# Altium schematic sheet rascal-1.2.schdoc: Rascal
size D; DrawnBy: Brandon Stafford; Engineer: Brandon Stafford; SheetNumber: 1; SheetTotal: 1; License: Creative Commons BY-SA-3_0-US; LicenseURL: http://creativecommons.org/licenses/by-sa/3.0/us/
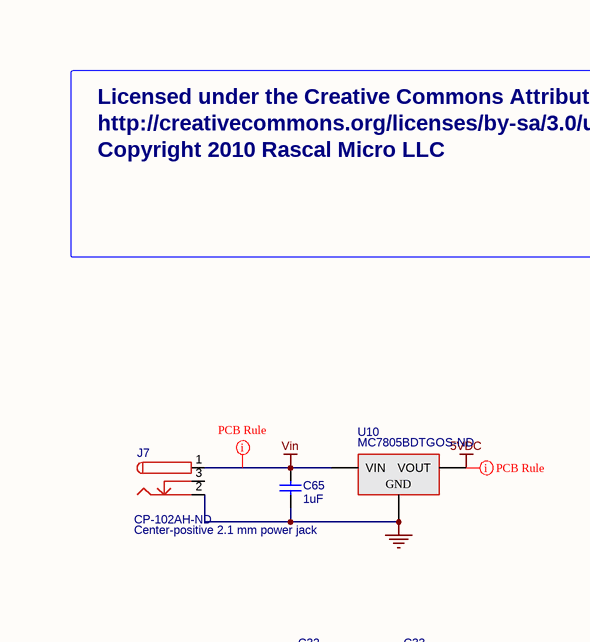
[diagram p0: rascal-1.2.schdoc, top left]
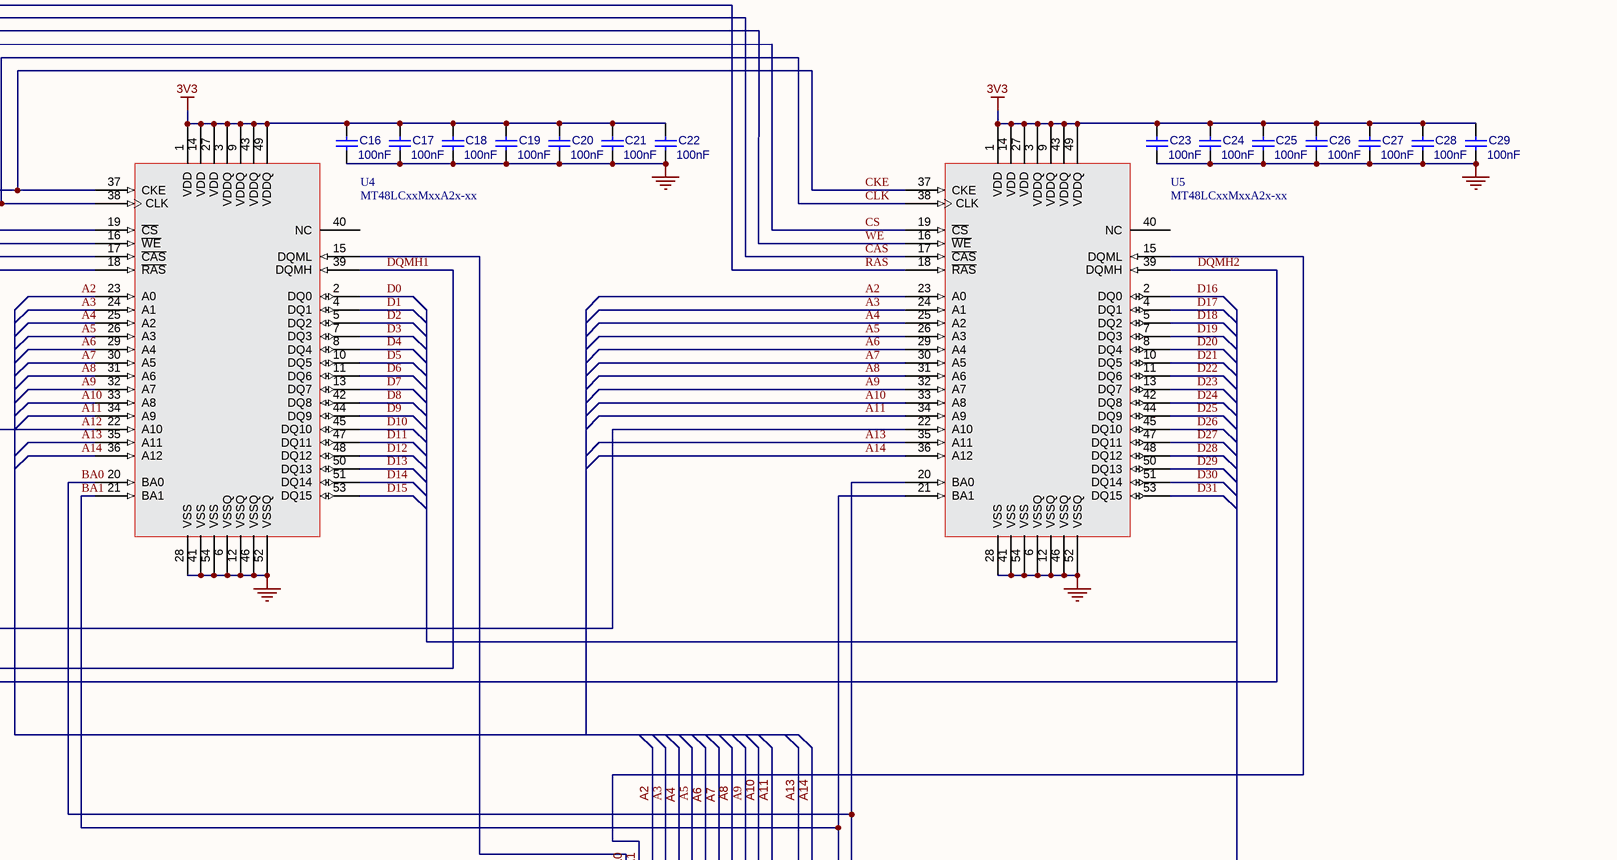
[diagram p1: rascal-1.2.schdoc, top right]
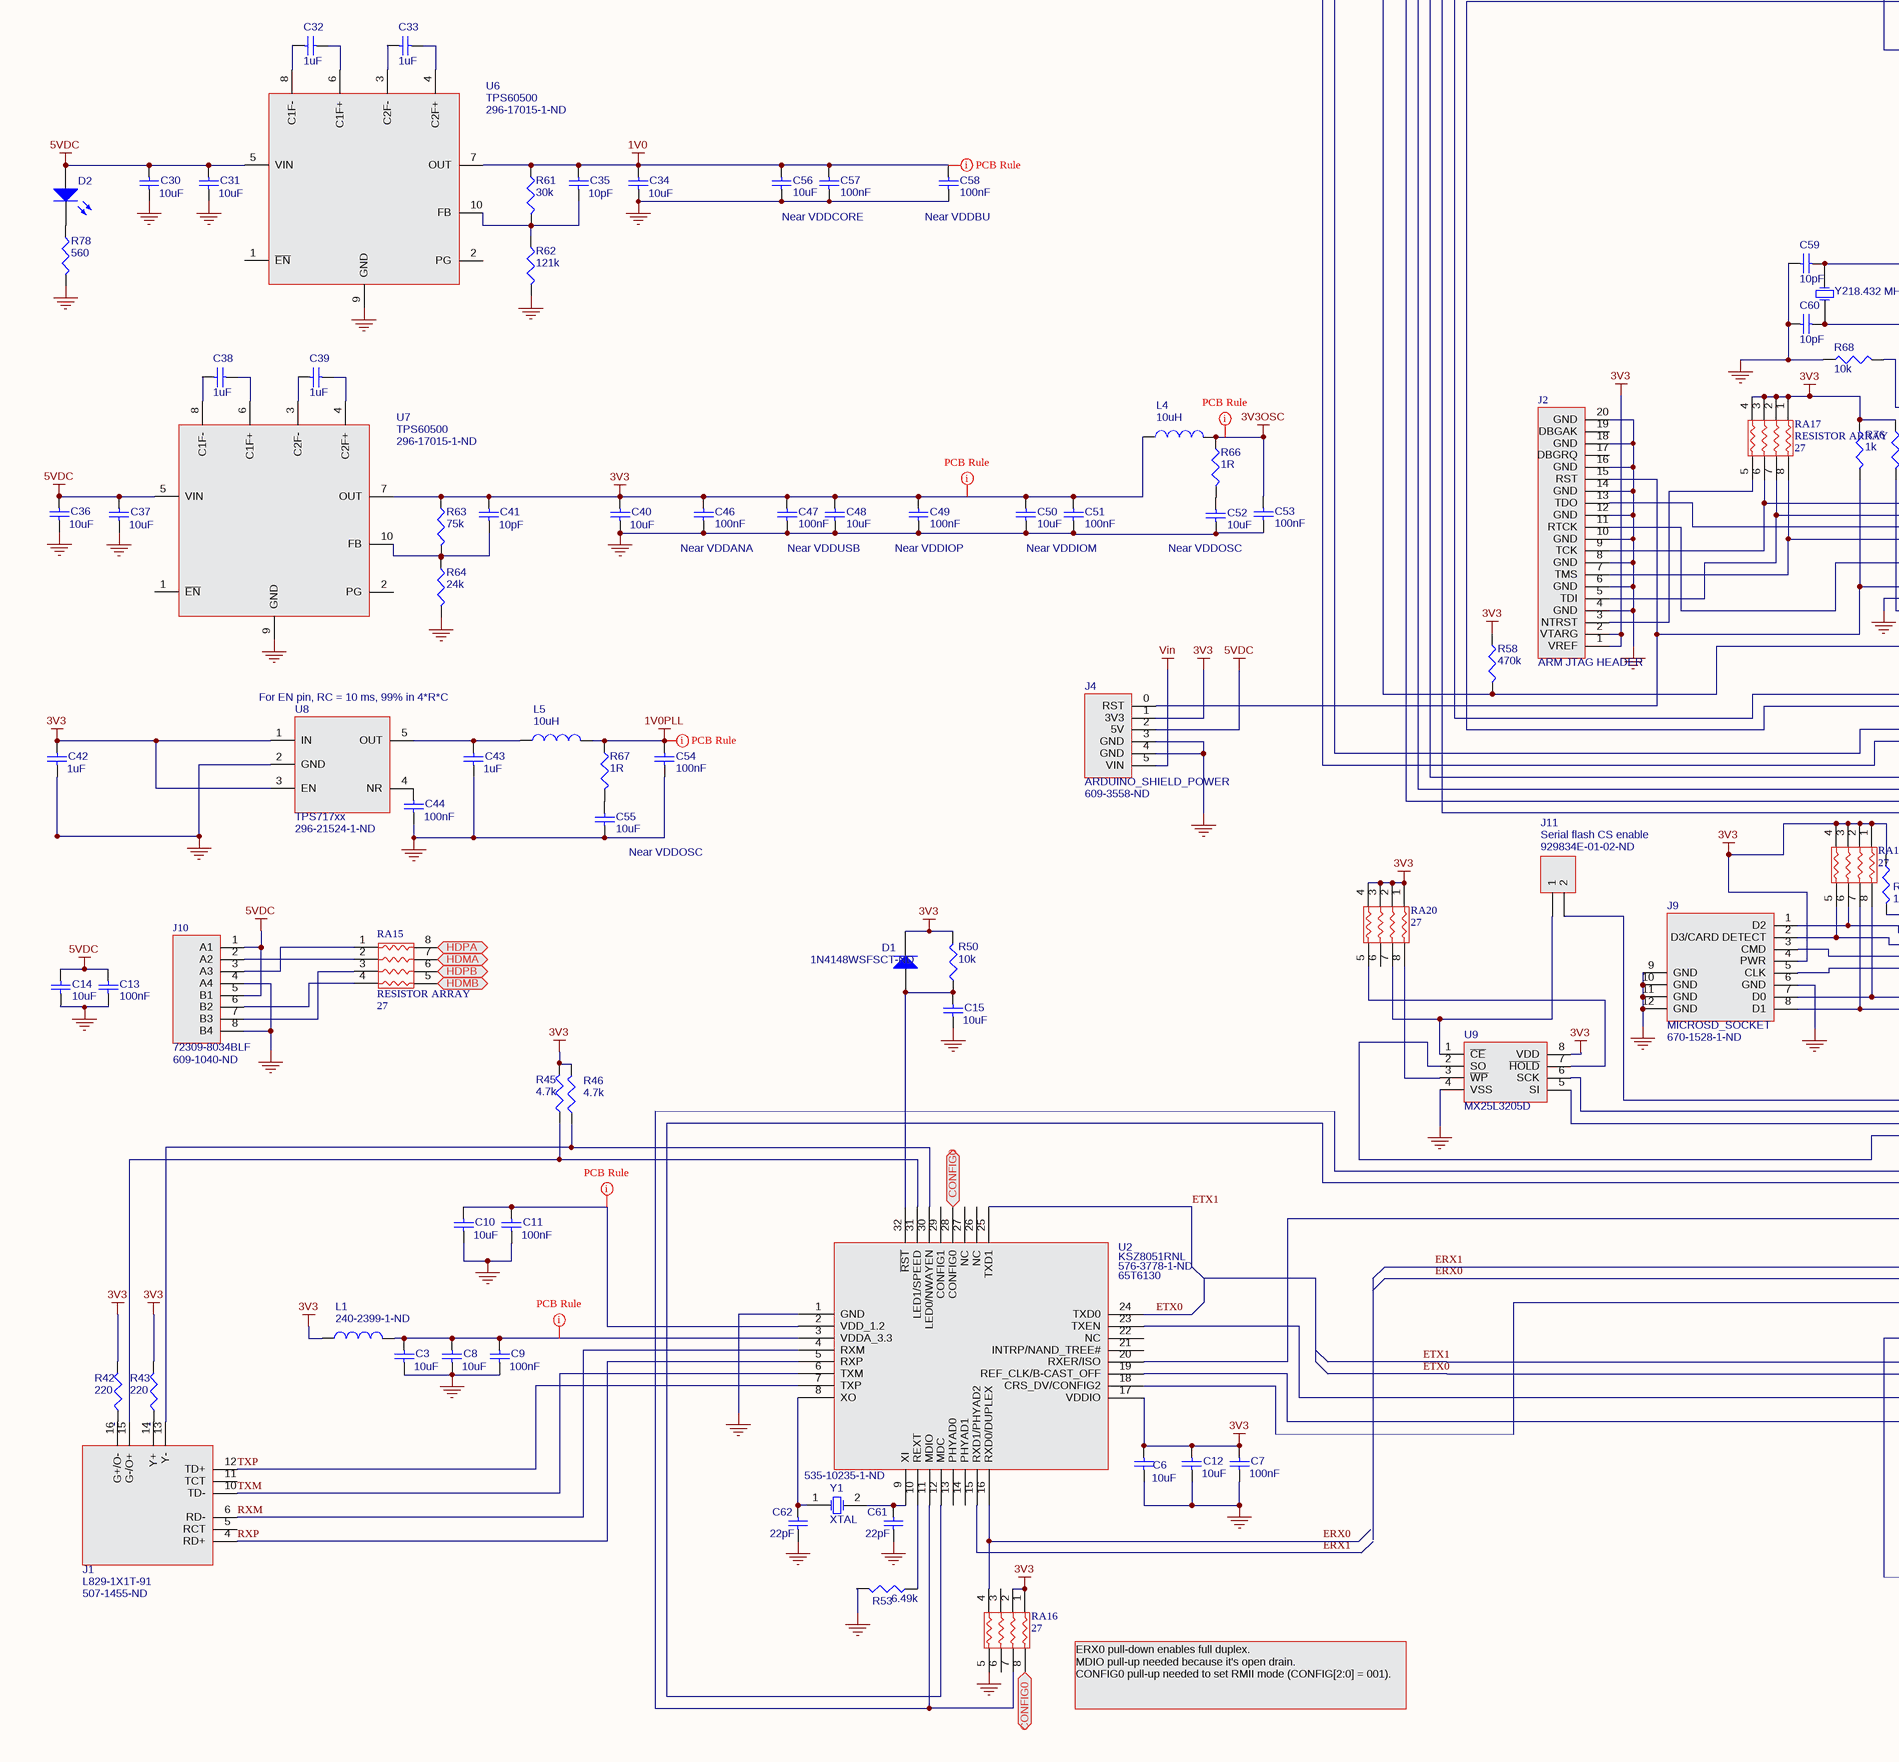
[diagram p2: rascal-1.2.schdoc, bottom left]
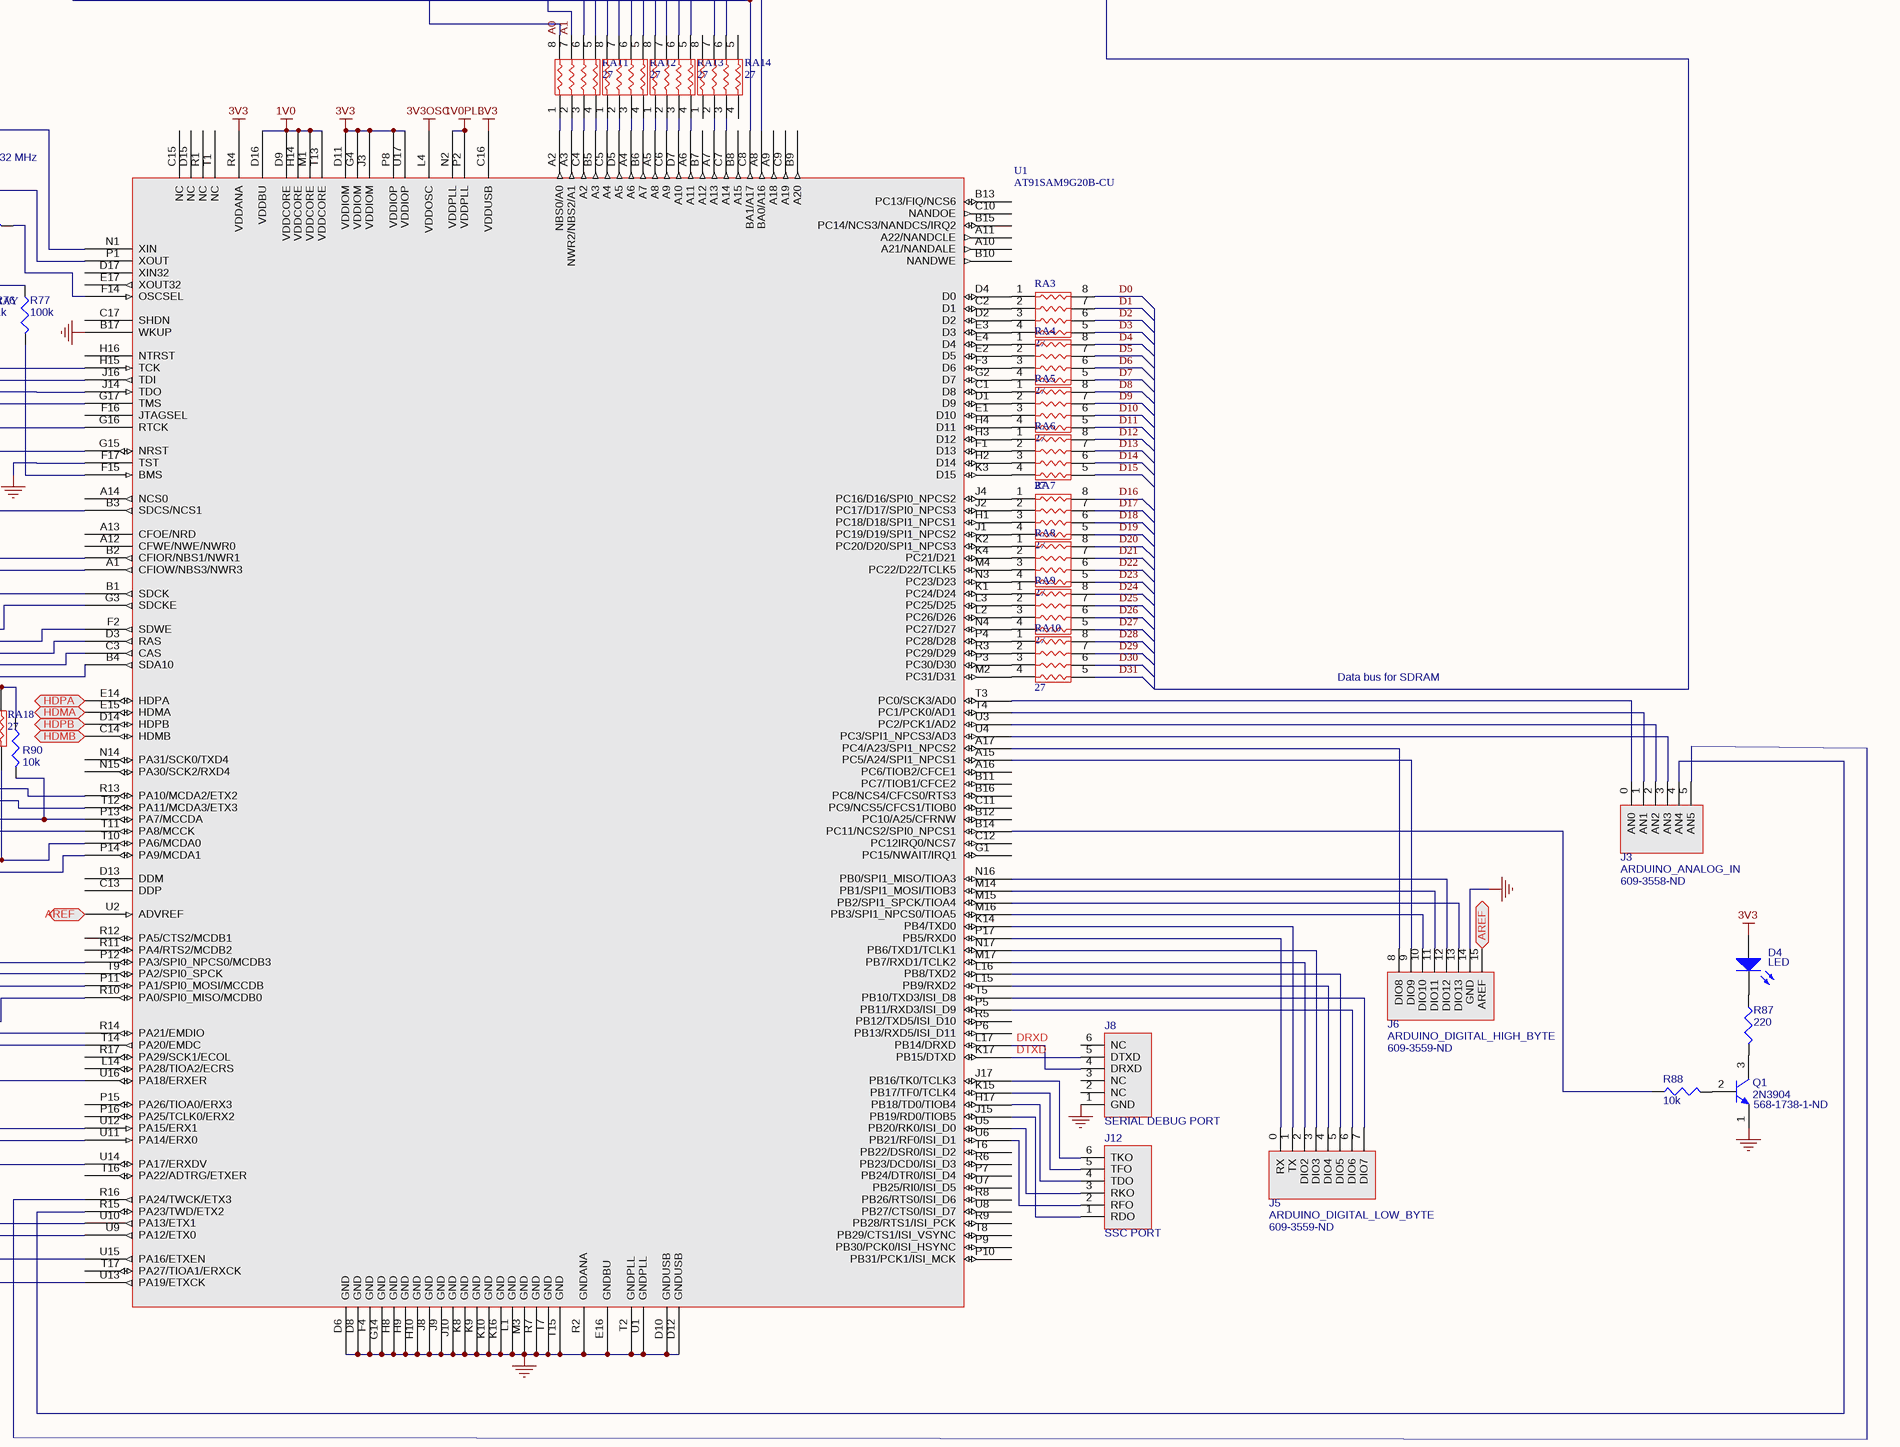
[diagram p3: rascal-1.2.schdoc, bottom right]

## Parts
C3  value 10uF  [CAPC2012N]  (hidden comment: Cap)
C6  value 10uF  [CAPC2012N]  (hidden comment: Cap)
C7  value 100nF  [CAPC1608N]  (hidden comment: Cap)
C8  value 10uF  [CAPC2012N]  (hidden comment: Cap)
C9  value 100nF  [CAPC1608N]  (hidden comment: Cap)
C10  value 10uF  [CAPC2012N]  (hidden comment: Cap)
C11  value 100nF  [CAPC1608N]  (hidden comment: Cap)
C12  value 10uF  [CAPC2012N]  (hidden comment: Cap)
C13  value 100nF  [CAPC1608N]  (hidden comment: Cap)
C14  value 10uF  [CAPC2012N]  (hidden comment: Cap)
C15  value 10uF  [CAPC2012N]  (hidden comment: Cap)
C16  value 100nF  [CAPC1608N]  (hidden comment: Cap)
C17  value 100nF  [CAPC1608N]  (hidden comment: Cap)
C18  value 100nF  [CAPC1608N]  (hidden comment: Cap)
C19  value 100nF  [CAPC1608N]  (hidden comment: Cap)
C20  value 100nF  [CAPC1608N]  (hidden comment: Cap)
C21  value 100nF  [CAPC1608N]  (hidden comment: Cap)
C22  value 100nF  [CAPC1608N]  (hidden comment: Cap)
C23  value 100nF  [CAPC1608N]  (hidden comment: Cap)
C24  value 100nF  [CAPC1608N]  (hidden comment: Cap)
C25  value 100nF  [CAPC1608N]  (hidden comment: Cap)
C26  value 100nF  [CAPC1608N]  (hidden comment: Cap)
C27  value 100nF  [CAPC1608N]  (hidden comment: Cap)
C28  value 100nF  [CAPC1608N]  (hidden comment: Cap)
C29  value 100nF  [CAPC1608N]  (hidden comment: Cap)
C30  value 10uF  [CAPC2012N]  (hidden comment: Cap)
C31  value 10uF  [CAPC2012N]  (hidden comment: Cap)
C32  value 1uF  [CAPC1608N]  (hidden comment: Cap)
C33  value 1uF  [CAPC1608N]  (hidden comment: Cap)
C34  value 10uF  [CAPC2012N]  (hidden comment: Cap)
C35  value 10pF  [CAPC1608N]  (hidden comment: Cap)
C36  value 10uF  [CAPC2012N]  (hidden comment: Cap)
C37  value 10uF  [CAPC2012N]  (hidden comment: Cap)
C38  value 1uF  [CAPC1608N]  (hidden comment: Cap)
C39  value 1uF  [CAPC1608N]  (hidden comment: Cap)
C40  value 10uF  [CAPC2012N]  (hidden comment: Cap)
C41  value 10pF  [CAPC1608N]  (hidden comment: Cap)
C42  value 1uF  [CAPC1608N]  (hidden comment: Cap)
C43  value 1uF  [CAPC1608N]  (hidden comment: Cap)
C44  value 100nF  [CAPC1608N]  (hidden comment: Cap)
C46  value 100nF  [CAPC1608N]  (hidden comment: Cap)
C47  value 100nF  [CAPC1608N]  (hidden comment: Cap)
C48  value 10uF  [CAPC2012N]  (hidden comment: Cap)
C49  value 100nF  [CAPC1608N]  (hidden comment: Cap)
C50  value 10uF  [CAPC2012N]  (hidden comment: Cap)
C51  value 100nF  [CAPC1608N]  (hidden comment: Cap)
C52  value 10uF  [CAPC2012N]  (hidden comment: Cap)
C53  value 100nF  [CAPC1608N]  (hidden comment: Cap)
C54  value 100nF  [CAPC1608N]  (hidden comment: Cap)
C55  value 10uF  [CAPC2012N]  (hidden comment: Cap)
C56  value 10uF  [CAPC2012N]  (hidden comment: Cap)
C57  value 100nF  [CAPC1608N]  (hidden comment: Cap)
C58  value 100nF  [CAPC1608N]  (hidden comment: Cap)
C59  value 10pF  [CAPC1608N]  (hidden comment: Cap)
C60  value 10pF  [CAPC1608N]  (hidden comment: Cap)
C61  value 22pF  [CAPC1608N]  (hidden comment: Cap)
C62  value 22pF  [CAPC1608N]  (hidden comment: Cap)
C65  value 1uF  [CAPC1608N]  (hidden comment: Cap)
D1  Supplier Part Number 1: 1N4148WSFSCT-ND  [SOD-323]  (hidden comment: Diode 1N4148)
D2  LED2  [CD2012-0805]  (value not drawn)
D4  LED  [CD2012-0805]
J1  L829-1X1T-91  Supplier Part Number 1: 507-1455-ND  [Bel L829-1X1T-91]
J2  ARM JTAG HEADER  [HDR1X10]
J3  ARDUINO_ANALOG_IN  Supplier Part Number 1: 609-3558-ND  [HDR1X6]
J4  ARDUINO_SHIELD_POWER  Supplier Part Number 1: 609-3558-ND  [HDR1X6]
J5  ARDUINO_DIGITAL_LOW_BYTE  Supplier Part Number 1: 609-3559-ND  [HDR1X8]
J6  ARDUINO_DIGITAL_HIGH_BYTE  Supplier Part Number 1: 609-3559-ND  [HDR1X8]
J7  Center-positive 2.1 mm power jack  Supplier Part Number 1: CP-102AH-ND  [PJ-102AH]
J8  SERIAL DEBUG PORT  [HDR1X6]
J9  MICROSD_SOCKET  Supplier Part Number 1: 670-1528-1-ND  [JAE SJ107021]
J10  72309-8034BLF  Supplier Part Number 2: 609-1040-ND  [72309-8034BLF]
J11  Serial flash CS enable  Supplier Part Number 1: 929834E-01-02-ND  [HDR1X2]
J12  SSC PORT  [HDR1X6]
L1  Supplier Part Number 1: 240-2399-1-ND  [INDC2012L]  (hidden comment: Inductor)
L4  value 10uH  [INDC2012L]  (hidden comment: Inductor)
L5  value 10uH  [INDC2012L]  (hidden comment: Inductor)
Q1  2N3904  Supplier Part Number 1: 568-1738-1-ND  [SOT23-3N]
R42  value 220  [RESC2012N]  (hidden comment: Res3)
R43  value 220  [RESC2012N]  (hidden comment: Res3)
R45  value 4.7k  [RESC2012N]  (hidden comment: Res3)
R46  value 4.7k  [RESC2012N]  (hidden comment: Res3)
R50  value 10k  [RESC2012N]  (hidden comment: Res3)
R53  value 6.49k  [RESC2012N]  (hidden comment: Res3)
R58  value 470k  [RESC2012N]  (hidden comment: Res3)
R61  value 30k  [RESC2012N]  (hidden comment: Res3)
R62  value 121k  [RESC2012N]  (hidden comment: Res3)
R63  value 75k  [RESC2012N]  (hidden comment: Res3)
R64  value 24k  [RESC2012N]  (hidden comment: Res3)
R66  value 1R  [RESC2012N]  (hidden comment: Res3)
R67  value 1R  [RESC2012N]  (hidden comment: Res3)
R68  value 10k  [RESC2012N]  (hidden comment: Res3)
R76  value 1k  [RESC2012N]  (hidden comment: Res3)
R77  value 100k  [RESC2012N]  (hidden comment: Res3)
R78  value 560  [RESC2012N]  (hidden comment: Res3)
R87  value 220  [RESC2012N]  (hidden comment: Res3)
R88  value 10k  [RESC2012N]  (hidden comment: Res3)
R90  value 10k  [RESC2012N]  (hidden comment: Res3)
RA3  value 27  [742C083]  (hidden comment: RESISTOR ARRAY)
RA4  value 27  [742C083]  (hidden comment: RESISTOR ARRAY)
RA5  value 27  [742C083]  (hidden comment: RESISTOR ARRAY)
RA6  value 27  [742C083]  (hidden comment: RESISTOR ARRAY)
RA7  value 27  [742C083]  (hidden comment: RESISTOR ARRAY)
RA8  value 27  [742C083]  (hidden comment: RESISTOR ARRAY)
RA9  value 27  [742C083]  (hidden comment: RESISTOR ARRAY)
RA10  value 27  [742C083]  (hidden comment: RESISTOR ARRAY)
RA11  value 27  [742C083]  (hidden comment: RESISTOR ARRAY)
RA12  value 27  [742C083]  (hidden comment: RESISTOR ARRAY)
RA13  value 27  [742C083]  (hidden comment: RESISTOR ARRAY)
RA14  value 27  [742C083]  (hidden comment: RESISTOR ARRAY)
RA15  RESISTOR ARRAY  value 27  [742C083]
RA16  value 27  [742C083]  (hidden comment: RESISTOR ARRAY)
RA17  RESISTOR ARRAY  value 27  [742C083]
RA18  value 27  [742C083]  (hidden comment: RESISTOR ARRAY)
RA20  value 27  [742C083]  (hidden comment: RESISTOR ARRAY)
U1  AT91SAM9G20B-CU  [AT91SAM9G20-CU]
U2  KSZ8051RNL  Supplier Part Number 1: 576-3778-1-ND  Supplier Part Number 2: 65T6130  [QFN50P500X500-32VBN]
U4  MT48LCxxMxxA2x-xx  [TSOP2-54_N]
U5  MT48LCxxMxxA2x-xx  [TSOP2-54_N]
U6  TPS60500  Supplier Part Number 1: 296-17015-1-ND  [TSSOP50P490-10AN]
U7  TPS60500  Supplier Part Number 1: 296-17015-1-ND  [TSSOP50P490-10AN]
U8  TPS717xx  Supplier Part Number 1: 296-21524-1-ND  [SOT353-5AN]
U9  MX25L3205D  [SOP127P780-8N]
U10  Supplier Part Number 1: MC7805BDTGOS-ND  [DPAK-3]  (hidden comment: VOLT REG)
Y1  XTAL  Supplier Part Number 1: 535-10235-1-ND  [HC49/4H_SMX]
Y2  18.432 MHz  [HC49/4H_SMX]

## Ports
AREF (out), CONFIG0 (out), HDMA (out), HDMB (out), HDPA (out), HDPB (out)

## Nets
1V0: C34.1 C35.1 C56.2 C57.2 C58.2 R61.1 U1.D9(VDDCORE) U1.D16(VDDBU) U1.H14(VDDCORE) U1.M1(VDDCORE) U1.T13(VDDCORE) U6.7(OUT)
1V0PLL: C54.2 L5.2 R67.1 U1.N2(VDDPLL) U1.P2(VDDPLL)
3V3: C6.1 C7.1 C12.1 C16.1 C17.1 C18.1 C19.1 C20.1 C21.1 C22.1 C23.1 C24.1 C25.1 C26.1 C27.1 C28.1 C29.1 C40.1 C41.1 C42.1 C46.1 C47.2 C48.2 C49.2 C50.2 C51.2 D1.2(K) D4.1(A) J2.1(VREF) J2.2(VTARG) J4.1(3V3) J9.4(PWR) L1.1 L4.1 R42.2 R43.2 R45.2 R46.2 R50.2 R58.1 R63.1 R76.1 R77.1 R90.1 RA16.1 RA16.2 RA17.1 RA17.2 RA17.3 RA17.4 RA18.1 RA18.2 RA18.3 RA18.4 RA20.1 RA20.2 RA20.3 RA20.4 U1.C16(VDDUSB) U1.D11(VDDIOM) U1.G4(VDDIOM) U1.J3(VDDIOM) U1.P8(VDDIOP) U1.R4(VDDANA) U1.U17(VDDIOP) U2.17(VDDIO) U4.1(VDD) U4.3(VDDQ) U4.9(VDDQ) U4.14(VDD) U4.27(VDD) U4.43(VDDQ) U4.49(VDDQ) U5.1(VDD) U5.3(VDDQ) U5.9(VDDQ) U5.14(VDD) U5.27(VDD) U5.43(VDDQ) U5.49(VDDQ) U7.7(OUT) U8.1(IN) U8.3(EN) U9.8(VDD)
3V3OSC: C53.2 L4.2 R66.1 U1.L4(VDDOSC)
5VDC: C13.2 C14.2 C30.1 C31.1 C36.1 C37.1 D2.1(A) J4.2(5V) J10.1(A1) J10.5(B1) U6.5(VIN) U7.5(VIN) U10.3(VOUT)
GND: C3.2 C6.2 C7.2 C8.2 C9.2 C10.2 C11.2 C12.2 C13.1 C14.1 C15.2 C16.2 C17.2 C18.2 C19.2 C20.2 C21.2 C22.2 C23.2 C24.2 C25.2 C26.2 C27.2 C28.2 C29.2 C30.2 C31.2 C34.2 C36.2 C37.2 C40.2 C42.2 C43.2 C44.2 C46.2 C47.1 C48.1 C49.1 C50.1 C51.1 C52.1 C53.1 C54.1 C55.1 C56.1 C57.1 C58.1 C59.1 C60.1 C61.2 C62.2 C65.1 J2.4(GND) J2.6(GND) J2.8(GND) J2.10(GND) J2.12(GND) J2.14(GND) J2.16(GND) J2.18(GND) J2.20(GND) J4.3(GND) J4.4(GND) J6.14(GND) J7.2 J8.1(GND) J9.6(GND) J9.9(GND) J9.10(GND) J9.11(GND) J9.12(GND) J10.4(A4) J10.8(B4) Q1.1(E) R53.2 R62.2 R64.2 R68.1 R78.2 RA16.5 U1.B17(WKUP) U1.D6(GND) U1.D8(GND) U1.D10(GNDUSB) U1.D12(GNDUSB) U1.E16(GNDBU) U1.F4(GND) U1.F17(TST) U1.G14(GND) U1.H8(GND) U1.H9(GND) U1.H10(GND) U1.J8(GND) U1.J9(GND) U1.J10(GND) U1.K8(GND) U1.K9(GND) U1.K10(GND) U1.K16(GND) U1.L1(GND) U1.M3(GND) U1.R2(GNDANA) U1.R7(GND) U1.T2(GNDPLL) U1.T7(GND) U1.T15(GND) U1.U1(GNDPLL) U2.1(GND) U4.6(VSSQ) U4.12(VSSQ) U4.28(VSS) U4.41(VSS) U4.46(VSSQ) U4.52(VSSQ) U4.54(VSS) U5.6(VSSQ) U5.12(VSSQ) U5.28(VSS) U5.41(VSS) U5.46(VSSQ) U5.52(VSSQ) U5.54(VSS) U6.9(GND) U7.9(GND) U8.2(GND) U9.4(VSS) U10.2(GND)
Vin: C65.2 J4.5(VIN) J7.1 U10.1(VIN)
A0: RA11.8 U4.15(DQML)
A1: RA11.7 U5.15(DQML)
A2: RA11.6 U4.23(A0) U5.23(A0)
A3: RA11.5 U4.24(A1) U5.24(A1)
A4: RA12.8 U4.25(A2) U5.25(A2)
A5: RA12.7 U4.26(A3) U5.26(A3)
A6: RA12.6 U4.29(A4) U5.29(A4)
A7: RA12.5 U4.30(A5) U5.30(A5)
A8: RA13.8 U4.31(A6) U5.31(A6)
A9: RA13.7 U4.32(A7) U5.32(A7)
A10: RA13.6 U4.33(A8) U5.33(A8)
A11: RA13.5 U4.34(A9) U5.34(A9)
A12: U1.B4(SDA10) U4.22(A10) U5.22(A10)
A13: RA14.7 U4.35(A11) U5.35(A11)
A14: RA14.6 U4.36(A12) U5.36(A12)
AREF: J6.15(AREF) U1.U2(ADVREF) ; port AREF
BA0: U1.A8(BA0/A16) U4.20(BA0) U5.20(BA0)
BA1: U1.C8(BA1/A17) U4.21(BA1) U5.21(BA1)
CAS: U1.C3(CAS) U4.17(~{CAS}) U5.17(~{CAS})
CKE: U1.G3(SDCKE) U4.37(CKE) U5.37(CKE)
CLK: U1.B1(SDCK) U4.38(CLK) U5.38(CLK)
CONFIG0: RA16.8 U2.28(CONFIG0) ; port CONFIG0
CS: R58.2 U1.B3(SDCS/NCS1) U4.19(~{CS}) U5.19(~{CS})
D0: RA3.8 U4.2(DQ0)
D1: RA3.7 U4.4(DQ1)
D2: RA3.6 U4.5(DQ2)
D3: RA3.5 U4.7(DQ3)
D4: RA4.8 U4.8(DQ4)
D5: RA4.7 U4.10(DQ5)
D6: RA4.6 U4.11(DQ6)
D7: RA4.5 U4.13(DQ7)
D8: RA5.8 U4.42(DQ8)
D9: RA5.7 U4.44(DQ9)
D10: RA5.6 U4.45(DQ10)
D11: RA5.5 U4.47(DQ11)
D12: RA6.8 U4.48(DQ12)
D13: RA6.7 U4.50(DQ13)
D14: RA6.6 U4.51(DQ14)
D15: RA6.5 U4.53(DQ15)
D16: RA7.8 U5.2(DQ0)
D17: RA7.7 U5.4(DQ1)
D18: RA7.6 U5.5(DQ2)
D19: RA7.5 U5.7(DQ3)
D20: RA8.8 U5.8(DQ4)
D21: RA8.7 U5.10(DQ5)
D22: RA8.6 U5.11(DQ6)
D23: RA8.5 U5.13(DQ7)
D24: RA9.8 U5.42(DQ8)
D25: RA9.7 U5.44(DQ9)
D26: RA9.6 U5.45(DQ10)
D27: RA9.5 U5.47(DQ11)
D28: RA10.8 U5.48(DQ12)
D29: RA10.7 U5.50(DQ13)
D30: RA10.6 U5.51(DQ14)
D31: RA10.5 U5.53(DQ15)
DQMH1: U1.B2(CFIOR/NBS1/NWR1) U4.39(DQMH)
DQMH2: U1.A1(CFIOW/NBS3/NWR3) U5.39(DQMH)
DRXD: J8.4(DRXD) U1.L17(PB14/DRXD)
DTXD: J8.5(DTXD) U1.K17(PB15/DTXD)
ERX0: RA16.4 U1.U11(PA14/ERX0) U2.16(RXD0/DUPLEX)
ERX1: U1.U12(PA15/ERX1) U2.15(RXD1/PHYAD2)
ETX0: U1.U9(PA12/ETX0) U2.24(TXD0)
ETX1: U1.U10(PA13/ETX1) U2.25(TXD1)
HDMA: RA15.7 U1.E15(HDMA) ; port HDMA
HDMB: RA15.5 U1.C14(HDMB) ; port HDMB
HDPA: RA15.8 U1.E14(HDPA) ; port HDPA
HDPB: RA15.6 U1.D14(HDPB) ; port HDPB
RAS: U1.D3(RAS) U4.18(~{RAS}) U5.18(~{RAS})
RXM: J1.6(RD-) U2.4(RXM)
RXP: J1.4(RD+) U2.5(RXP)
TXM: J1.10(TD-) U2.6(TXM)
TXP: J1.12(TD+) U2.7(TXP)
WE: U1.F2(SDWE) U4.16(~{WE}) U5.16(~{WE})
NetC3_1: C3.1 C8.1 C9.1 L1.2 U2.3(VDDA_3.3)
NetC10_1: C10.1 C11.1 U2.2(VDD_1.2)
NetC15_1: C15.1 D1.1(A) R50.1 U2.32(~{RST})
NetC32_1: C32.1 U6.8(C1F-)
NetC32_2: C32.2 U6.6(C1F+)
NetC33_1: C33.1 U6.3(C2F-)
NetC33_2: C33.2 U6.4(C2F+)
NetC35_2: C35.2 R61.2 R62.1 U6.10(FB)
NetC38_1: C38.1 U7.8(C1F-)
NetC38_2: C38.2 U7.6(C1F+)
NetC39_1: C39.1 U7.3(C2F-)
NetC39_2: C39.2 U7.4(C2F+)
NetC41_2: C41.2 R63.2 R64.1 U7.10(FB)
NetC43_1: C43.1 L5.1 U8.5(OUT)
NetC44_1: C44.1 U8.4(NR)
NetC52_2: C52.2 R66.2
NetC55_2: C55.2 R67.2
NetC59_2: C59.2 U1.N1(XIN) Y2.2(OSC2)
NetC60_2: C60.2 U1.P1(XOUT) Y2.1(OSC1)
NetC61_1: C61.1 U2.9(XI) Y1.2(OSC2)
NetC62_1: C62.1 U2.8(XO) Y1.1(OSC1)
NetD2_2: D2.2(K) R78.1
NetD4_2: D4.2(K) R87.1
NetJ1_13: J1.13(Y-) R46.1 U2.30(LED0/NWAYEN)
NetJ1_14: J1.14(Y+) R43.1
NetJ1_15: J1.15(G-/O+) R45.1 U2.31(LED1/SPEED)
NetJ1_16: J1.16(G+/O-) R42.1
NetJ2_3: J2.3(NTRST) RA17.5
NetJ2_5: J2.5(TDI) RA17.7 U1.J16(TDI)
NetJ2_7: J2.7(TMS) RA17.8 U1.G17(TMS)
NetJ2_9: J2.9(TCK) RA17.6 U1.H15(TCK)
NetJ2_11: J2.11(RTCK) U1.G16(RTCK)
NetJ2_13: J2.13(TDO) U1.J14(TDO)
NetJ2_15: J2.15(RST) J4.0(RST) R76.2 U1.G15(NRST)
NetJ3_0: J3.0(AN0) U1.T3(PC0/SCK3/AD0)
NetJ3_1: J3.1(AN1) U1.T4(PC1/PCK0/AD1)
NetJ3_2: J3.2(AN2) U1.U3(PC2/PCK1/AD2)
NetJ3_3: J3.3(AN3) U1.U4(PC3/SPI1_NPCS3/AD3)
NetJ3_4: J3.4(AN4) U1.R15(PA23/TWD/ETX2)
NetJ3_5: J3.5(AN5) U1.R16(PA24/TWCK/ETX3)
NetJ5_0: J5.0(RX) U1.P17(PB5/RXD0)
NetJ5_1: J5.1(TX) U1.K14(PB4/TXD0)
NetJ5_2: J5.2(DIO2) U1.M17(PB7/RXD1/TCLK2)
NetJ5_3: J5.3(DIO3) U1.N17(PB6/TXD1/TCLK1)
NetJ5_4: J5.4(DIO4) U1.L15(PB9/RXD2)
NetJ5_5: J5.5(DIO5) U1.L16(PB8/TXD2)
NetJ5_6: J5.6(DIO6) U1.P5(PB11/RXD3/ISI_D9)
NetJ5_7: J5.7(DIO7) U1.T5(PB10/TXD3/ISI_D8)
NetJ6_8: J6.8(DIO8) U1.A17(PC4/A23/SPI1_NPCS2)
NetJ6_9: J6.9(DIO9) U1.A15(PC5/A24/SPI1_NPCS1)
NetJ6_10: J6.10(DIO10) U1.M16(PB3/SPI1_NPCS0/TIOA5)
NetJ6_11: J6.11(DIO11) U1.M14(PB1/SPI1_MOSI/TIOB3)
NetJ6_12: J6.12(DIO12) U1.N16(PB0/SPI1_MISO/TIOA3)
NetJ6_13: J6.13(DIO13) U1.M15(PB2/SPI1_SPCK/TIOA4)
NetJ9_1: J9.1(D2) RA18.6 U1.R13(PA10/MCDA2/ETX2)
NetJ9_2: J9.2(D3/CARD_DETECT) RA18.5 U1.T12(PA11/MCDA3/ETX3)
NetJ9_3: J9.3(CMD) R90.2 U1.P13(PA7/MCCDA)
NetJ9_5: J9.5(CLK) U1.T11(PA8/MCCK)
NetJ9_7: J9.7(D0) RA18.8 U1.T10(PA6/MCDA0)
NetJ9_8: J9.8(D1) RA18.7 U1.P14(PA9/MCDA1)
NetJ10_2: J10.2(A2) RA15.2
NetJ10_3: J10.3(A3) RA15.1
NetJ10_6: J10.6(B2) RA15.4
NetJ10_7: J10.7(B3) RA15.3
NetJ11_1: J11.1 RA20.7 U9.1(~{CE})
NetJ11_2: J11.2 U1.P12(PA3/SPI0_NPCS0/MCDB3)
NetJ12_1: J12.1(RDO) U1.J15(PB19/RD0/TIOB5)
NetJ12_2: J12.2(RFO) U1.U6(PB21/RF0/ISI_D1)
NetJ12_3: J12.3(RKO) U1.U5(PB20/RK0/ISI_D0)
NetJ12_4: J12.4(TDO) U1.H17(PB18/TD0/TIOB4)
NetJ12_5: J12.5(TFO) U1.K15(PB17/TF0/TCLK4)
NetJ12_6: J12.6(TKO) U1.J17(PB16/TK0/TCLK3)
NetQ1_2: Q1.2(B) R88.2
NetQ1_3: Q1.3(C) R87.2
NetR53_1: R53.1 U2.10(REXT)
NetR68_2: R68.2 U1.F14(OSCSEL)
NetR77_2: R77.2 U1.F15(BMS)
NetR88_1: R88.1 U1.B14(PC11/NCS2/SPI0_NPCS1)
NetRA3_1: RA3.1 U1.D4(D0)
NetRA3_2: RA3.2 U1.C2(D1)
NetRA3_3: RA3.3 U1.D2
NetRA3_4: RA3.4 U1.E3(D3)
NetRA4_1: RA4.1 U1.E4(D4)
NetRA4_2: RA4.2 U1.E2(D5)
NetRA4_3: RA4.3 U1.F3(D6)
NetRA4_4: RA4.4 U1.G2(D7)
NetRA5_1: RA5.1 U1.C1(D8)
NetRA5_2: RA5.2 U1.D1(D9)
NetRA5_3: RA5.3 U1.E1(D10)
NetRA5_4: RA5.4 U1.H4(D11)
NetRA6_1: RA6.1 U1.H3(D12)
NetRA6_2: RA6.2 U1.F1(D13)
NetRA6_3: RA6.3 U1.H2(D14)
NetRA6_4: RA6.4 U1.K3(D15)
NetRA7_1: RA7.1 U1.J4(PC16/D16/SPI0_NPCS2)
NetRA7_2: RA7.2 U1.J2(PC17/D17/SPI0_NPCS3)
NetRA7_3: RA7.3 U1.H1(PC18/D18/SPI1_NPCS1)
NetRA7_4: RA7.4 U1.J1(PC19/D19/SPI1_NPCS2)
NetRA8_1: RA8.1 U1.K2(PC20/D20/SPI1_NPCS3)
NetRA8_2: RA8.2 U1.K4(PC21/D21)
NetRA8_3: RA8.3 U1.M4(PC22/D22/TCLK5)
NetRA8_4: RA8.4 U1.N3(PC23/D23)
NetRA9_1: RA9.1 U1.K1(PC24/D24)
NetRA9_2: RA9.2 U1.L3(PC25/D25)
NetRA9_3: RA9.3 U1.L2(PC26/D26)
NetRA9_4: RA9.4 U1.N4(PC27/D27)
NetRA10_1: RA10.1 U1.P4(PC28/D28)
NetRA10_2: RA10.2 U1.R3(PC29/D29)
NetRA10_3: RA10.3 U1.P3(PC30/D30)
NetRA10_4: RA10.4 U1.M2(PC31/D31)
NetRA11_1: RA11.1 U1.A2(NBS0/A0)
NetRA11_2: RA11.2 U1.A3(NWR2/NBS2/A1)
NetRA11_3: RA11.3 U1.C4(A2)
NetRA11_4: RA11.4 U1.B5(A3)
NetRA12_1: RA12.1 U1.C5(A4)
NetRA12_2: RA12.2 U1.D5(A5)
NetRA12_3: RA12.3 U1.A4(A6)
NetRA12_4: RA12.4 U1.B6(A7)
NetRA13_1: RA13.1 U1.A5(A8)
NetRA13_2: RA13.2 U1.C6(A9)
NetRA13_3: RA13.3 U1.D7(A10)
NetRA13_4: RA13.4 U1.A6(A11)
NetRA14_2: RA14.2 U1.A7(A13)
NetRA14_3: RA14.3 U1.C7(A14)
NetRA16_7: RA16.7 U1.R14(PA21/EMDIO) U2.11(MDIO)
NetRA20_5: RA20.5 U9.7(~{HOLD})
NetRA20_8: RA20.8 U9.3(~{WP})
NetU1_P11: U1.P11(PA1/SPI0_MOSI/MCCDB) U9.5(SI)
NetU1_R10: U1.R10(PA0/SPI0_MISO/MCDB0) U9.2(SO)
NetU1_T9: U1.T9(PA2/SPI0_SPCK) U9.6(SCK)
NetU1_T14: U1.T14(PA20/EMDC) U2.12(MDC)
NetU1_U13: U1.U13(PA19/ETXCK) U2.19(REF_CLK/B-CAST_OFF)
NetU1_U14: U1.U14(PA17/ERXDV) U2.18(CRS_DV/CONFIG2)
NetU1_U15: U1.U15(PA16/ETXEN) U2.23(TXEN)
NetU1_U16: U1.U16(PA18/ERXER) U2.20(RXER/ISO)

Not connected (* = marked no-connect by the designer): J1 5(RCT) 11(TCT); J2 17(DBGRQ) 19(DBGAK); J7 3; J8 2(NC) 3(NC) 6(NC); RA14 1 4 5 8; RA16 3 6; RA20 6; U1 A9(A18) A10(A21/NANDALE) A11(A22/NANDCLE) A12(CFWE/NWE/NWR0) A13(CFOE/NRD) A14(NCS0) A16(PC6/TIOB2/CFCE1) B7(A12) B8(A15) B9(A20) B10(NANDWE) B11(PC7/TIOB1/CFCE2) B12(PC10/A25/CFRNW) B13(PC13/FIQ/NCS6) B15(PC14/NCS3/NANDCS/IRQ2) B16(PC8/NCS4/CFCS0/RTS3) C9(A19) C10(NANDOE) C11(PC9/NCS5/CFCS1/TIOB0) C12(PC12IRQ0/NCS7) C13(DDP) C15(NC) C17(SHDN) D13(DDM) D15(NC) D17(XIN32) E17(XOUT32) F16(JTAGSEL) G1(PC15/NWAIT/IRQ1) H16(NTRST) L14(PA28/TIOA2/ECRS) N14(PA31/SCK0/TXD4) N15(PA30/SCK2/RXD4) P6(PB13/RXD5/ISI_D11) P7(PB24/DTR0/ISI_D4) P9(PB30/PCK0/ISI_HSYNC) P10(PB31/PCK1/ISI_MCK) P15(PA26/TIOA0/ERX3) P16(PA25/TCLK0/ERX2) R1(NC) R5(PB12/TXD5/ISI_D10) R6(PB23/DCD0/ISI_D3) R8(PB26/RTS0/ISI_D6) R9(PB28/RTS1/ISI_PCK) R11(PA4/RTS2/MCDB2) R12(PA5/CTS2/MCDB1) R17(PA29/SCK1/ECOL) T1(NC) T6(PB22/DSR0/ISI_D2) T8(PB29/CTS1/ISI_VSYNC) T16(PA22/ADTRG/ETXER) T17(PA27/TIOA1/ERXCK) U7(PB25/RI0/ISI_D5) U8(PB27/CTS0/ISI_D7); U2 13(PHYAD0) 14(PHYAD1) 21(INTRP/NAND_TREE#) 22(NC) 26(NC) 27(NC) 29(CONFIG1); U4 40(NC); U5 40(NC); U6 1(~{EN}) 2(PG); U7 1(~{EN}) 2(PG)

## Layout directives
rule Supply Nets [Voltage = 3.300]: 3V3, 3V3OSC, NetC3_1
rule Supply Nets [Voltage = 1.000]: 1V0, 1V0PLL
rule Supply Nets [Voltage = 5.000]: 5VDC
rule Supply Nets [Voltage = 9.000]: Vin
rule Supply Nets [Voltage = 1.200]: NetC10_1

## Notes on the sheet
- Licensed under the Creative Commons Attribution-Share Alike 3.0 United States license
- http://creativecommons.org/licenses/by-sa/3.0/us/
- Copyright 2010 Rascal Micro LLC
- Near VDDCORE
- (near C58) Near VDDBU
- (near C46) Near VDDANA
- Near VDDUSB
- (near C49) Near VDDIOP
- Near VDDIOM
- (near C52) Near VDDOSC
- For EN pin, RC = 10 ms, 99% in 4*R*C
- Data bus for SDRAM
- (near C55) Near VDDOSC
- ERX0 pull-down enables full duplex.
  MDIO pull-up needed because it's open drain.
  CONFIG0 pull-up needed to set RMII mode (CONFIG[2:0] = 001).

## Library data of the parts
C3 C6-C44 C46-C62 C65 = Cap: Capacitor; Published: 8-Jun-2000; LatestRevisionDate: 17-Jul-2002; LatestRevisionNote: Re-released for DXP Platform.; PackageReference: RAD-0.3; Publisher: Altium Limited; Supplier 1: Digi-Key
  C3 C6 C8 C10 C12 C14 C15 C30 C31 C34 C36 C37 C40 C48 C50 C52 C55 C56: Supplier Part Number 1: 587-1303-1-ND
  C7 C9 C11 C13 C16-C29 C44 C46 C47 C49 C51 C53 C54 C57 C58: Supplier Part Number 1: 445-1316-1-ND
  C32 C33 C38 C39 C42 C43 C65: Supplier Part Number 1: 445-5138-1-ND
  C35 C41 C59 C60: Supplier Part Number 1: 445-1269-1-ND
  C61 C62: Supplier Part Number 1: 445-1273-1-ND
D1 = Diode 1N4148: Diode; Published: 8-Jun-2000; LatestRevisionDate: 17-Jul-2002; LatestRevisionNote: Re-released for DXP Platform.; DatasheetVersion: 1997; PackageReference: DO-35; Publisher: Altium Limited; Code_JEDEC: DO-204-AH; ComponentLink1Description: Manufacturer Link; ComponentLink1URL: http://www.fairchildsemi.com/; ComponentLink2Description: Datasheet; ComponentLink2URL: http://www.fairchildsemi.com/ds/1N%2F1N4148.pdf; Supplier 1: Digi-Key
D2 D4 = LED2: Green LED; Published: 8-Jun-2000; LatestRevisionDate: 17-Jul-2002; LatestRevisionNote: Re-released for DXP Platform.; PackageVersion: Feb-2002; PackageReference: 3.2X1.6X1.1; Publisher: Altium Limited; Supplier 1: Digi-Key; Supplier Part Number 1: 160-1179-1-ND
J1 = L829-1X1T-91: RJ45 jack; Supplier 1: Digi-Key
J2 = ARM JTAG HEADER: Secret JTAG port; pin to pad: 4>10 5>4 6>10 7>5 8>10 9>6 11>7 12>10 13>8 14>10 15>9 16>10 17>10 18>10 19>10 20>10
J3 = ARDUINO_ANALOG_IN: 6-pin socket; pin to pad: 0>1 1>2 2>3 3>4 4>5 5>6; Supplier 1: Digi-Key
J4 = ARDUINO_SHIELD_POWER: 6-pin socket; pin to pad: 0>1 1>2 2>3 3>4 4>5 5>6; Supplier 1: Digi-Key
J5 = ARDUINO_DIGITAL_LOW_BYTE: 8-pin socket; pin to pad: 0>1 1>2 2>3 3>4 4>5 5>6 6>7 7>8; Supplier 1: Digi-Key
J6 = ARDUINO_DIGITAL_HIGH_BYTE: 8-pin socket; pin to pad: 8>1 9>2 10>3 11>4 12>5 13>6 14>7 15>8; Supplier 1: Digi-Key
J7 = PWR2.5: Power jack; Published: 17-Dec-2003; DatasheetDocument: 09-May-2002; Publisher: Altium Limited; ComponentLink1Description: Manufacturer Link; ComponentLink1URL: http://domino.kycon.com/internet/Products.html; Supplier 1: Digi-Key
J8 J12 = ARDUINO_ANALOG_IN: 6-pin socket; pin to pad: 0>1; Supplier 1: Digi-Key; Supplier Part Number 1: 609-3558-ND
J9 = MICROSD_SOCKET: MicroSD card socket; Supplier 1: Digi-Key
J10 = 72309-8034BLF: USB double decker jack; Supplier 1: Newark; Supplier 2: Digi-Key; Supplier Part Number 1: 43K4479
J11 = JUMPER: 2-pin jumper; Supplier 1: Digi-Key
L1 = Inductor: Code_IEC: 1005; Value: 10mH; Published: 8-Jun-2000; LatestRevisionDate: 29-May-2009; LatestRevisionNote: IPC-7351 Footprint Added.; PackageReference: 0402-A; Publisher: Altium Limited; PackageDescription: Chip Inductor; Code_JEITA: 0402; Supplier 1: Digi-Key
L4 L5 = Inductor: Code_IEC: 1005; Published: 8-Jun-2000; LatestRevisionDate: 29-May-2009; LatestRevisionNote: IPC-7351 Footprint Added.; PackageReference: 0402-A; Publisher: Altium Limited; PackageDescription: Chip Inductor; Code_JEITA: 0402; Supplier 1: Digi-Key; Supplier Part Number 1: 587-1691-1-ND
Q1 = 2N3904: NPN transistor; pin to pad: 1>2 2>1; Published: 8-Jun-2000; LatestRevisionDate: 15-Jan-2003; LatestRevisionNote: PCB Footprint 'BCY-W3/D4.7' replaced; DatasheetVersion: 1997; PackageVersion: Sep-1998; PackageReference: TO-92A; Publisher: Altium Limited; Code_JEDEC: TO-92A; ComponentLink1Description: Manufacturer Link; ComponentLink1URL: http://www.fairchildsemi.com/; ComponentLink2Description: Datasheet; ComponentLink2URL: http://www.fairchildsemi.com/ds/2N%2F2N3904.pdf; Supplier 1: Digi-Key
R42 R43 R45 R46 R50 R53 R58 R61-R64 R66-R68 R76-R78 R87 R88 R90 = Res3: Resistor; Published: 8-Jun-2000; LatestRevisionDate: 29-May-2009; LatestRevisionNote: IPC-7351 Footprint Added.; PackageReference: J1-0603; Publisher: Altium Limited; PackageDescription: Chip Resistor; Supplier 1: Digi-Key
  R42 R43 R87: Supplier Part Number 1: RMCF0805JT220RCT-ND
  R45 R46: Supplier Part Number 1: RMCF0805JT4K70CT-ND
  R50 R68 R88 R90: Supplier Part Number 1: RMCF0805JT10K0CT-ND
  R53: Supplier Part Number 1: RMCF0805FT6K49CT-ND
  R58: Supplier Part Number 1: RMCF0805JT470KCT-ND
  R61: Supplier Part Number 1: RMCF0805JT30K0CT-ND
  R62: Supplier Part Number 1: RMCF0805FT121KCT-ND
  R63: Supplier Part Number 1: RMCF0805FT75K0CT-ND
  R64: Supplier Part Number 1: RMCF0805JT24K0CT-ND
  R66 R67: Supplier Part Number 1: RMCF0805JT1R00CT-ND
  R76: Supplier Part Number 1: RMCF0805JT1K00CT-ND
  R77: Supplier Part Number 1: RMCF0805JT100KCT-ND
  R78: Supplier Part Number 1: RMCF0805JT560RCT-ND
U1 = AT91SAM9G20B-CU: Microcontroller
U2 = KSZ8051RNL: Ethernet transceiver; Supplier 1: Digi-Key; Supplier 2: Newark
U4 U5 = MT48LCxxMxxA2x-xx: SDRAM
U6 U7 = TPS60500: Step-down charge pump; Supplier 1: Digi-Key
U8 = TPS717xx: Low-dropout regulator; Supplier 1: Digi-Key
U9 = MX25L3205D: Serial flash; Supplier 1: Future Electronics; Supplier Part Number 1: MX25L3205DM2I-12G
U10 = VOLT REG: Voltage regulator; Published: 24-Mar-1999; LatestRevisionDate: 29-May-2009; LatestRevisionNote: IPC-7351 Footprint Added.; PackageReference: D2PAK; Publisher: Altium Limited; PackageDescription: 3-Pin Transistor Outline Package 2.54 mm Pitch, 15.1 mm Lead Span; Supplier 1: Digi-Key
Y1 = XTAL: Crystal; Value: 25.000 MHz; Published: 8-Jun-2000; LatestRevisionDate: 17-Jul-2002; LatestRevisionNote: Re-released for DXP Platform.; PackageReference: R38; Publisher: Altium Limited; Supplier 1: Digi-Key
Y2 = XTAL: Crystal; Published: 8-Jun-2000; LatestRevisionDate: 17-Jul-2002; LatestRevisionNote: Re-released for DXP Platform.; PackageReference: R38; Publisher: Altium Limited; Supplier 1: Digi-Key; Supplier Part Number 1: 535-10230-1-ND; Value: 18.432MHz